# Altium schematic sheet SML-230109PCB1__NFC.SchDoc
size A4; DocumentNumber: 5; SheetNumber: 5; SheetTotal: 6
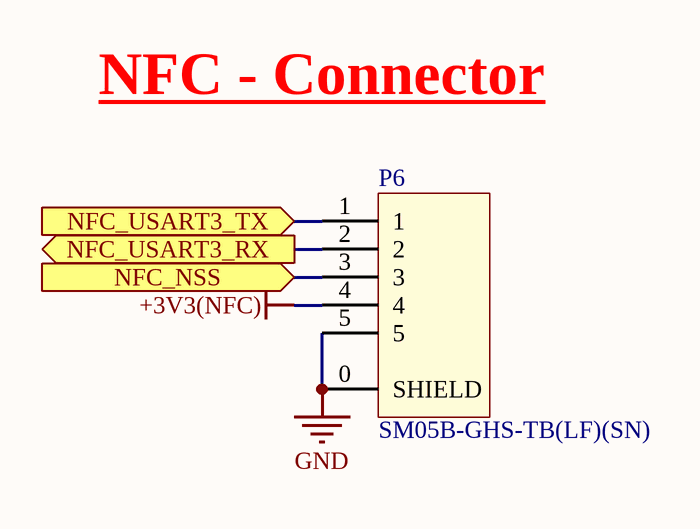
[diagram p0: SML-230109PCB1__NFC.SchDoc]

## Parts
P6  .  [CONN-SMD__JST(5PIN)__SM05B-GHS-TB(LF)(SN)]  (value not drawn)

## Ports
NFC_NSS (in, see 3[1B]), NFC_USART3_RX (out, see 3[1B]), NFC_USART3_TX (in, see 3[1B])

## Nets
+3V3(NFC): P6.4
GND: P6.0(SHIELD) P6.5
NFC_NSS: P6.3 ; port NFC_NSS
NFC_USART3_RX: P6.2 ; port NFC_USART3_RX
NFC_USART3_TX: P6.1 ; port NFC_USART3_TX

## Notes on the sheet
- NFC - Connector
- Title
- Size:
- Date:
- A4
- Number:
- Revision:
- Sheet
- of
- SEMILLA3 OÜ
- Seebi tn 1-1501, Tallinn 11316. Estonia.
- Registry No.: 16636757
- VAT No. EE102568505
- File:

## Library data of the parts
P6 = SM05B-GHS-TB(LF)(SN): CONN SMD, JST, side entry, 1x5pin, with lock, 1A, 50V; [04] - Power features: 1A (AC/DC), 50V (AC/DC); [05] - Temperature range: -25 to +85 ºC; [06] - Package: 1x5pin, pitch=1'25mm; Matching connector: GHR-05V-S; [00] - Description (BOM): CONN SMD, JST, side entry, 1x5pin, with lock, 1A, 50V; [02] - Manufacturer: JST; [03] - Datasheet: https://www.jst-mfg.com/product/pdf/eng/eGH.pdf; [07] - PVP Dealer name: *; [08] - PVP 1K: *; STAR Code: *; [01] - MPN Code: SM05B-GHS-TB(LF)(SN)